# Altium schematic sheet Power.SchDoc
size A; SheetNumber: 1; SheetTotal: 2
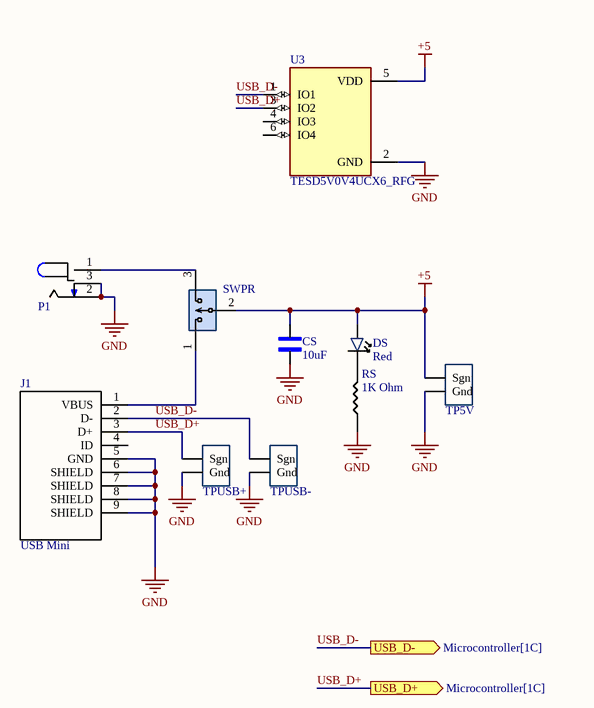
[diagram p0: Power.SchDoc]

## Parts
CS  10uF  [1206_Passive_Capacitor]
DS  Red  [LED_1206]
J1  USB Mini  [USB_MINI_B]
P1  Power Jack  [Power_Jack]  (value not drawn)
RS  value 1K Ohm  [1206_Passive_Resitor]  (hidden comment: 1k)
SWPR  PREC003SAAN-RC  [3_PIN_100mil]  (value not drawn)
TP5V  10x Probe TP  [TP10x_Probe]  (value not drawn)
TPUSB+  10x Probe TP  [TP10x_Probe]  (value not drawn)
TPUSB-  10x Probe TP  [TP10x_Probe]  (value not drawn)
U3  TESD5V0V4UCX6_RFG  [SOT95P280X145-6N]

## Ports
USB_D+ (out, see Microcontroller[1C]), USB_D- (out, see Microcontroller[1C])

## Nets
+5: CS.2 DS.1 SWPR.2 TP5V.1(Sgn) U3.5(VDD)
GND: CS.1 J1.5(GND) J1.6(SHIELD) J1.7(SHIELD) J1.8(SHIELD) J1.9(SHIELD) P1.2 P1.3 RS.1 TP5V.2(Gnd) TPUSB+.2(Gnd) TPUSB-.2(Gnd) U3.2(GND)
USB_D+: J1.3(D+) TPUSB+.1(Sgn) U3.3(IO2) ; port USB_D+
USB_D-: J1.2(D-) TPUSB-.1(Sgn) U3.1(IO1) ; port USB_D-
NetDS_2: DS.2 RS.2
NetJ1_1: J1.1(VBUS) SWPR.1
NetP1_1: P1.1 SWPR.3

Not connected (* = marked no-connect by the designer): J1 4(ID); U3 4(IO3) 6(IO4)

## Library data of the parts
CS = C_10uF_1206: 10uF ±10% 50V X5R 1206 Multilayer Ceramic Capacitors MLCC - SMD/SMT RoHS; MFR Part #: CL31A106KBHNNNE; LCSC Part#: C13585; Datasheet: https://datasheet.lcsc.com/lcsc/1810221112_Samsung-Electro-Mechanics-CL31A106KBHNNNE_C13585.pdf; Type: Basic; Value: 10uF
DS = LED_RED_1206: Red 621~631nm 1206 Light Emitting Diodes (LED) RoHS; MFR Part #: 15-21/R6C-FQ1R1B/2T; LCSC Part#: C93133; Type: Extended; Datasheet: https://datasheet.lcsc.com/szlcsc/1811151241_Everlight-Elec-15-21-R6C-FQ1R1B-2T_C93133.pdf; Value: Red
J1 = J_USB_B_Mini: Through Hole USB Connectors RoHS; MFR Part #: 920-462A2021D10102; Value: USB mini B; LCSC Part#: C46398; Datasheet: https://datasheet.lcsc.com/szlcsc/2103081233_Jing-Extension-of-the-Electronic-Co-920-462A2021D10102_C46398.pdf; Type: Extended
P1 = P_Power Jack: Power Barrel Connector Jack 2.10mm ID (0.083"), 5.50mm OD (0.217") Through Hole, Right Angle; MFR Part #: PJ-102A; Value: CONN PWR JACK 2X5.5MM SOLDER; Digikey Link: https://www.digikey.com/product-detail/en/PJ-102A/CP-102A-ND/275425/?itemSeq=304982367; LCSC Part#: C136744; Type: Extended
RS = R_1K_1206: CHIP RESISTOR - SURFACE MOUNT 1KOHMS ±1% 1/4W 1206 ROHS; MFR Part #: RNCP1206FTD1K00CT; Digikey Link: https://www.digikey.com/product-detail/en/RNCP1206FTD1K00/RNCP1206FTD1K00CT-ND/2240675/?itemSeq=304982373; LCSC Part#: C4410; Type: Basic
SWPR = SW_3Pin_100mil_Switch: Connector Header Through Hole 3 position 0.100" (2.54mm); Value: CONN HEADER VERT 3POS 2.54MM; Digikey Link: https://www.digikey.com/product-detail/en/PREC003SAAN-RC/S1012EC-03-ND/2774851/?itemSeq=304982371; MFR Part #: PREC003SAAN-RC; Type: Extended; LCSC Part#: C49257
TP5V TPUSB+ TPUSB- = TP_10x_Probe: Test Point 300 mil centers
U3 = TESD5V0V4UCX6_RFG: SOT-26, 5V, 75W, 0.6pF, ESD Protection; MF: Taiwan Semiconductor; MP: TESD5V0V4UCX6 RFG; SnapEDA_Link: https://www.snapeda.com/parts/TESD5V0V4UCX6%20RFG/Taiwan+Semiconductor/view-part/?ref=snap; Package: None; Value: *; Check_prices: https://www.snapeda.com/parts/TESD5V0V4UCX6%20RFG/Taiwan+Semiconductor/view-part/?ref=eda